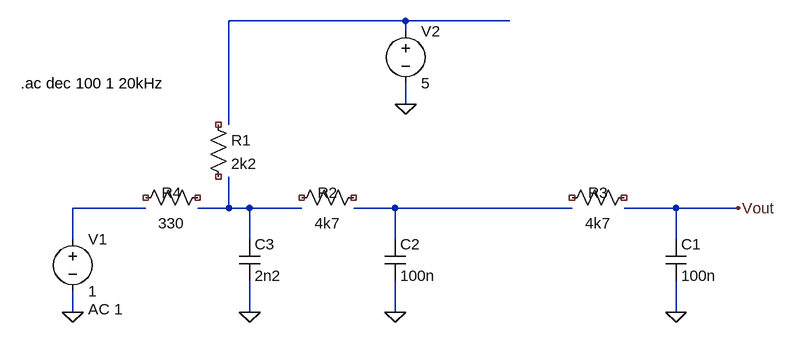
[diagram p0: schematic analog_in_test.asc]
analog_in_test.asc, the LTspice schematic file:
Version 4
SHEET 1 920 680
WIRE 336 -80 64 -80
WIRE 496 -80 336 -80
WIRE 336 -64 336 -80
WIRE 336 48 336 16
WIRE 64 80 64 -80
WIRE -64 208 -176 208
WIRE 64 208 64 160
WIRE 64 208 16 208
WIRE 96 208 64 208
WIRE 176 208 96 208
WIRE 320 208 256 208
WIRE 592 208 320 208
WIRE 752 208 672 208
WIRE 848 208 752 208
WIRE -176 256 -176 208
WIRE 96 256 96 208
WIRE 320 256 320 208
WIRE 752 256 752 208
WIRE -176 368 -176 336
WIRE 96 368 96 320
WIRE 320 368 320 320
WIRE 752 368 752 320
FLAG 320 368 0
FLAG 752 368 0
FLAG -176 368 0
FLAG 848 208 Vout
FLAG 336 48 0
FLAG 96 368 0
SYMBOL res 32 64 R0
SYMATTR InstName R1
SYMATTR Value 2k2
SYMBOL res 272 176 R90
WINDOW 0 24 56 VBottom 2
WINDOW 3 40 56 VTop 2
SYMATTR InstName R2
SYMATTR Value 4k7
SYMBOL res 688 176 R90
WINDOW 0 24 56 VBottom 2
WINDOW 3 40 56 VTop 2
SYMATTR InstName R3
SYMATTR Value 4k7
SYMBOL cap 736 256 R0
SYMATTR InstName C1
SYMATTR Value 100n
SYMBOL cap 304 256 R0
SYMATTR InstName C2
SYMATTR Value 100n
SYMBOL voltage 336 -80 R0
WINDOW 123 0 0 Left 0
WINDOW 39 0 0 Left 0
SYMATTR InstName V2
SYMATTR Value 5
SYMBOL res 32 176 R90
WINDOW 0 24 56 VBottom 2
WINDOW 3 40 56 VTop 2
SYMATTR InstName R4
SYMATTR Value 330
SYMBOL voltage -176 240 R0
WINDOW 123 24 124 Left 2
WINDOW 39 0 0 Left 0
SYMATTR Value2 AC 1
SYMATTR InstName V1
SYMATTR Value 1
SYMBOL cap 80 256 R0
SYMATTR InstName C3
SYMATTR Value 2n2
TEXT -256 16 Left 2 !.ac dec 100 1 20kHz

The netlist it stands for:
* analog_in_test.asc
R1 NC_01 NC_02 2k2
R2 NC_03 NC_04 4k7
R3 NC_05 NC_06 4k7
C1 Vout 0 100n
C2 N004 0 100n
V2 N001 0 5
R4 NC_07 NC_08 330
V1 N002 0 1 AC 1
C3 N003 0 2n2
.ac dec 100 1 20kHz
.backanno
.end